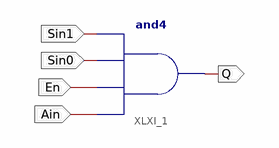
[diagram p0: schematic sheet 1]
// Xilinx ISE schematic DEMUX_1_4.sch (spartan3e) as structural Verilog: 1 symbols, 5 ports
module DEMUX_1_4 (
  input  Sin1,
  input  Sin0,
  input  En,
  input  Ain,
  output Q
);

  and XLXI_1 (Q, Ain, En, Sin0, Sin1);
endmodule
